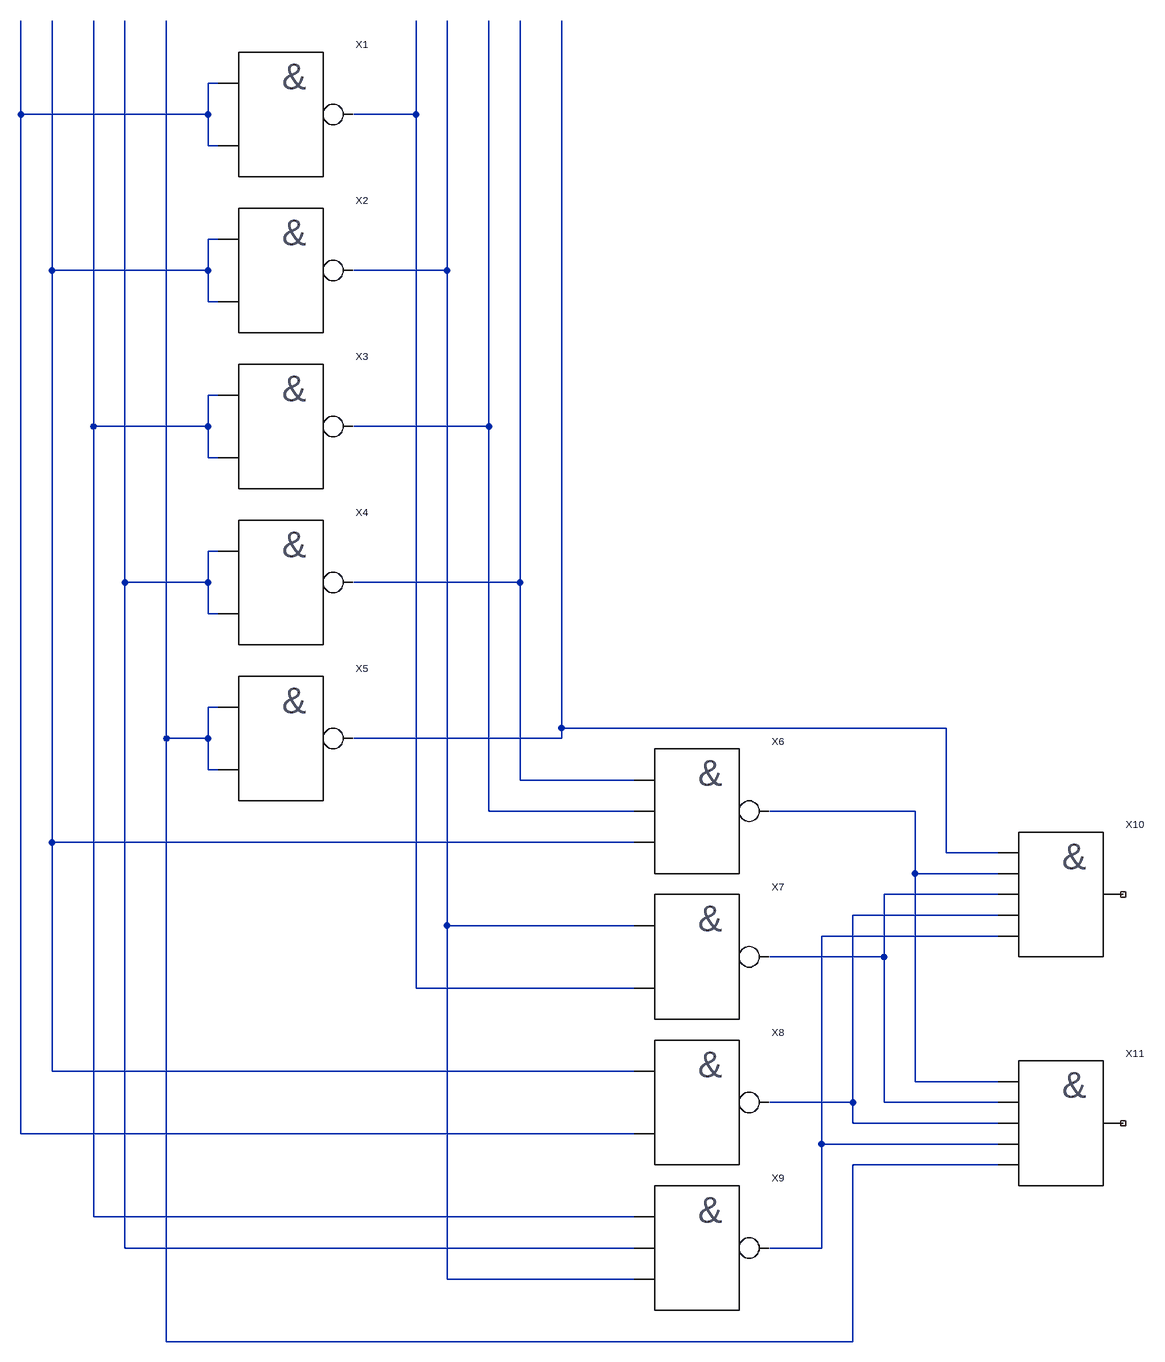
[diagram p0: schematic korr.asc]
korr.asc, the LTspice schematic file:
Version 4
SHEET 1 1336 2548
WIRE -64 528 -80 528
WIRE -368 576 -368 432
WIRE -80 576 -80 528
WIRE -80 576 -368 576
WIRE 240 576 240 432
WIRE 240 576 144 576
WIRE -80 624 -80 576
WIRE -64 624 -80 624
WIRE -64 768 -80 768
WIRE -320 816 -320 432
WIRE -80 816 -80 768
WIRE -80 816 -320 816
WIRE 288 816 288 432
WIRE 288 816 144 816
WIRE -80 864 -80 816
WIRE -64 864 -80 864
WIRE -64 1008 -80 1008
WIRE -256 1056 -256 432
WIRE -80 1056 -80 1008
WIRE -80 1056 -256 1056
WIRE 352 1056 352 432
WIRE 352 1056 144 1056
WIRE -80 1104 -80 1056
WIRE -64 1104 -80 1104
WIRE -64 1248 -80 1248
WIRE -208 1296 -208 432
WIRE -80 1296 -80 1248
WIRE -80 1296 -208 1296
WIRE 400 1296 400 432
WIRE 400 1296 144 1296
WIRE -80 1344 -80 1296
WIRE -64 1344 -80 1344
WIRE -64 1488 -80 1488
WIRE 464 1520 464 432
WIRE 1056 1520 464 1520
WIRE -144 1536 -144 432
WIRE -80 1536 -80 1488
WIRE -80 1536 -144 1536
WIRE 464 1536 464 1520
WIRE 464 1536 144 1536
WIRE -80 1584 -80 1536
WIRE -64 1584 -80 1584
WIRE 400 1600 400 1296
WIRE 576 1600 400 1600
WIRE 352 1648 352 1056
WIRE 576 1648 352 1648
WIRE 1008 1648 784 1648
WIRE -320 1696 -320 816
WIRE 576 1696 -320 1696
WIRE 1056 1712 1056 1520
WIRE 1136 1712 1056 1712
WIRE 1008 1744 1008 1648
WIRE 1136 1744 1008 1744
WIRE 1136 1776 960 1776
WIRE 1136 1808 912 1808
WIRE 288 1824 288 816
WIRE 576 1824 288 1824
WIRE 1136 1840 864 1840
WIRE 960 1872 960 1776
WIRE 960 1872 784 1872
WIRE 240 1920 240 576
WIRE 576 1920 240 1920
WIRE -320 2048 -320 1696
WIRE 576 2048 -320 2048
WIRE 1008 2064 1008 1744
WIRE 1136 2064 1008 2064
WIRE 912 2096 912 1808
WIRE 912 2096 784 2096
WIRE 960 2096 960 1872
WIRE 1136 2096 960 2096
WIRE 912 2128 912 2096
WIRE 1136 2128 912 2128
WIRE -368 2144 -368 576
WIRE 576 2144 -368 2144
WIRE 864 2160 864 1840
WIRE 1136 2160 864 2160
WIRE 1136 2192 912 2192
WIRE -256 2272 -256 1056
WIRE 576 2272 -256 2272
WIRE -208 2320 -208 1296
WIRE 576 2320 -208 2320
WIRE 864 2320 864 2160
WIRE 864 2320 784 2320
WIRE 288 2368 288 1824
WIRE 576 2368 288 2368
WIRE -144 2464 -144 1536
WIRE 912 2464 912 2192
WIRE 912 2464 -144 2464
SYMBOL NAND2 32 576 R0
SYMATTR InstName X1
SYMBOL NAND2 32 816 R0
SYMATTR InstName X2
SYMBOL NAND2 32 1296 R0
SYMATTR InstName X4
SYMBOL NAND2 32 1536 R0
SYMATTR InstName X5
SYMBOL NAND3 672 1648 R0
SYMATTR InstName X6
SYMBOL NAND2 672 1872 R0
SYMATTR InstName X7
SYMBOL NAND2 672 2096 R0
SYMATTR InstName X8
SYMBOL NAND3 672 2320 R0
SYMATTR InstName X9
SYMBOL AND5 1232 1776 R0
SYMATTR InstName X10
SYMBOL AND5 1232 2128 R0
SYMATTR InstName X11
SYMBOL NAND2 32 1056 R0
SYMATTR InstName X3

The netlist it stands for:
* korr.asc
XX1 N001 N001 N002 NAND2  ; pins a b o
XX2 N003 N003 N004 NAND2  ; pins a b o
XX4 N007 N007 N008 NAND2  ; pins a b o
XX5 N009 N009 N010 NAND2  ; pins a b o
XX6 N008 N003 N011 N006 NAND3  ; pins a b o c
XX7 N004 N002 N012 NAND2  ; pins a b o
XX8 N003 N001 N013 NAND2  ; pins a b o
XX9 N005 N004 N014 N007 NAND3  ; pins a b o c
XX10 N010 N014 NC_01 N011 N013 N012 AND5  ; pins a b o c d e
XX11 N011 N009 NC_02 N012 N014 N013 AND5  ; pins a b o c d e
XX3 N005 N005 N006 NAND2  ; pins a b o
.backanno
.end